# Altium project Mercury_AD_BaseBoard.PrjPcb (part 4 of 4)
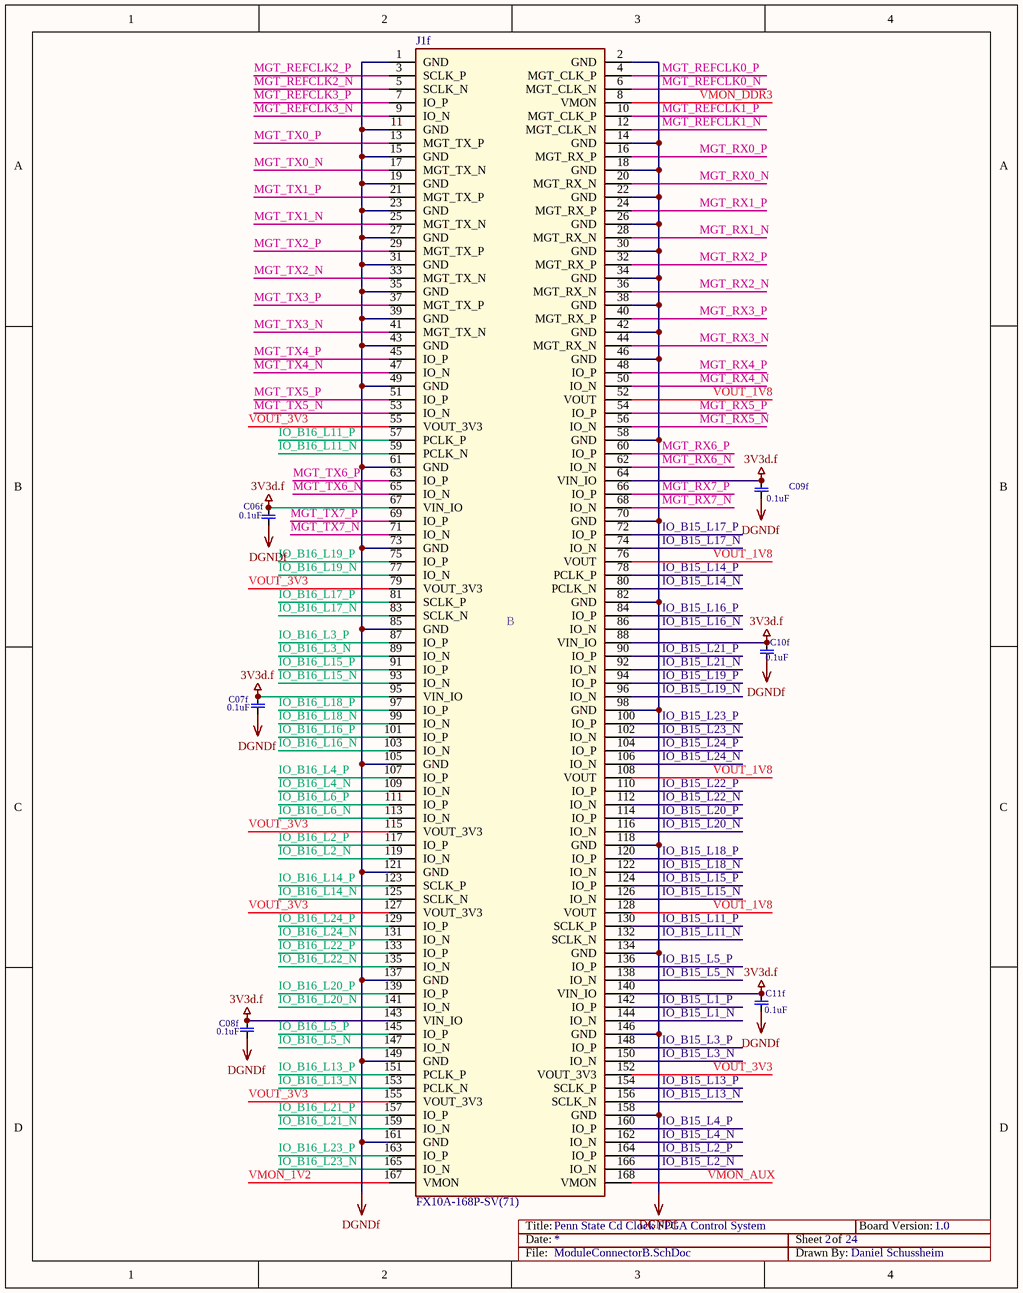
[diagram p24: ModuleConnectorB.SchDoc]

## Nets that join several sheets
1V8a.a: LTC2194_0 (L07a0.1), LTC2194_1 (L07a1.1), LTC2194_2 (L07a2.1), LTC2194_3 (L07a3.1), LTC2194_4 (L07a4.1)
1V8a.b: MAX5875_0 (L09b0.1), MAX5875_1 (L13b1.1), MAX5875_2 (L13b2.1), MAX5875_3 (L13b3.1), MAX5875_4 (L13b4.1), MAX5875_5 (L13b5.1), MAX5875_6 (L13b6.1)
1V8d.a: LTC2194_0 (L06a0.1), LTC2194_1 (L06a1.1), LTC2194_2 (L06a2.1), LTC2194_3 (L06a3.1), LTC2194_4 (L06a4.1)
1V8d.b: MAX5875_0 (L06b0.1), MAX5875_1 (L10b1.1), MAX5875_2 (L10b2.1), MAX5875_3 (L10b3.1), MAX5875_4 (L10b4.1), MAX5875_5 (L10b5.1), MAX5875_6 (L10b6.1)
2V5d.e: Connectors (9 pins), SerialLineShiftRegs (C16e.1 U1e.2 U1e.10)
2V5d.f: ModuleConnectorA (8 pins), fastADCs (Ra1.1)
3V3a.a: LTC2194_0 (L08a0.1 L11a0.1), LTC2194_1 (L08a1.1 L11a1.1), LTC2194_2 (L08a2.1 L11a2.1), LTC2194_3 (L08a3.1 L11a3.1), LTC2194_4 (L08a4.1 L11a4.1)
3V3a.b: MAX5875_0 (L10b0.1), MAX5875_1 (L14b1.1), MAX5875_2 (L14b2.1), MAX5875_3 (L14b3.1), MAX5875_4 (L14b4.1), MAX5875_5 (L14b5.1), MAX5875_6 (L14b6.1)
3V3d.b: MAX5875_0 (L07b0.1 R02b0.2 R05b0.2), MAX5875_1 (L11b1.1 R02b1.2 R05b1.2), MAX5875_2 (L11b2.1 R02b2.2 R05b2.2), MAX5875_3 (L11b3.1 R02b3.2 R05b3.2), MAX5875_4 (L11b4.1 R02b4.2 R05b4.2), MAX5875_5 (L11b5.1 R02b5.2 R05b5.2), MAX5875_6 (L11b6.1 R02b6.2 R05b6.2)
3V3d.c: LTC2335-16_0 (L05c0.1), LTC2335-16_1 (L5c1.1)
3V3d.f: ModuleConnectorC (6 pins), ModuleConnectorB (12 pins)
5.c: LTC2335-16_0 (L04c0.1), LTC2335-16_1 (L4c1.1)
+15.a: LTC2194_0 (L09a0.1), LTC2194_1 (L09a1.1), LTC2194_2 (L09a2.1), LTC2194_3 (L09a3.1), LTC2194_4 (L09a4.1)
+15.c: LTC2335-16_0 (L02c0.1), LTC2335-16_1 (L2c1.1)
+18.b: MAX5875_0 (L11b0.1), MAX5875_1 (L15b1.1), MAX5875_2 (L15b2.1), MAX5875_3 (L15b3.1), MAX5875_4 (L15b4.1), MAX5875_5 (L15b5.1), MAX5875_6 (L15b6.1)
+18.c: LTC2335-16_0 (L00c0.1), LTC2335-16_1 (L0c1.1)
+18.d0: LTC2666-16 (C62d0.1 C63d0.1 L21d0.2), sDAC_filters_0 (16 pins)
+18.d1: LTC2666-16 (C62d1.1 C63d1.1 L21d1.2), sDAC_filters_1 (16 pins)
-15.a: LTC2194_0 (L10a0.1), LTC2194_1 (L10a1.1), LTC2194_2 (L10a2.1), LTC2194_3 (L10a3.1), LTC2194_4 (L10a4.1)
-15.c: LTC2335-16_0 (L03c0.1), LTC2335-16_1 (L3c1.1)
-18.b: MAX5875_0 (L12b0.1), MAX5875_1 (L16b1.1), MAX5875_2 (L16b2.1), MAX5875_3 (L16b3.1), MAX5875_4 (L16b4.1), MAX5875_5 (L16b5.1), MAX5875_6 (L16b6.1)
-18.c: LTC2335-16_0 (L01c0.1), LTC2335-16_1 (L1c1.1)
-18.d0: LTC2666-16 (C64c0.1 C65c0.1 L22d0.2), sDAC_filters_0 (16 pins)
-18.d1: LTC2666-16 (C64c1.1 C65c1.1 L22d1.2), sDAC_filters_1 (16 pins)
AGNDa: ModuleConnectorA (34 pins), fastDACs (20 pins), MAX5875_0 (81 pins), MAX5875_1 (81 pins), MAX5875_2 (81 pins), MAX5875_3 (81 pins), MAX5875_4 (81 pins), MAX5875_5 (81 pins), MAX5875_6 (81 pins), LTC2666-16 (64 pins), sDAC_filters_0 (48 pins), sDAC_filters_1 (48 pins), LTC2335-16_0 (85 pins), LTC2335-16_1 (85 pins), Connectors (20 pins), SerialLineShiftRegs (40 pins), ModuleConnectorC (57 pins), fastADCs (16 pins), LTC2194_0 (66 pins), LTC2194_1 (66 pins), LTC2194_2 (66 pins), LTC2194_3 (66 pins), LTC2194_4 (66 pins), ModuleConnectorB (43 pins)
BOOT_MODE: ModuleConnectorA (J0f.126), Connectors (R04e.2)
ETH0_A_N: ModuleConnectorA (J0f.163), Connectors (J2e.10)
ETH0_A_P: ModuleConnectorA (J0f.165), Connectors (J2e.11)
ETH0_B_N: ModuleConnectorA (J0f.157), Connectors (J2e.5)
ETH0_B_P: ModuleConnectorA (J0f.159), Connectors (J2e.4)
ETH0_C_N: ModuleConnectorA (J0f.151), Connectors (J2e.2)
ETH0_C_P: ModuleConnectorA (J0f.153), Connectors (J2e.3)
ETH0_CTREF: ModuleConnectorA (J0f.155), Connectors (J2e.1 J2e.6 J2e.7 J2e.12)
ETH0_D_N: ModuleConnectorA (J0f.145), Connectors (J2e.9)
ETH0_D_P: ModuleConnectorA (J0f.147), Connectors (J2e.8)
ETH0_LED1#: ModuleConnectorA (J0f.149), Connectors (J2e.14)
ETH0_LED2#: ModuleConnectorA (J0f.161), Connectors (J2e.16)
fDAC0_PD: MAX5875_0 (R04b0.2), ModuleConnectorC (U0f.15)
fDAC1_PD: MAX5875_1 (R04b1.2), ModuleConnectorC (U0f.1)
fDAC2_PD: MAX5875_2 (R04b2.2), ModuleConnectorC (U0f.2)
fDAC3_PD: MAX5875_3 (R04b3.2), ModuleConnectorC (U0f.3)
fDAC4_PD: MAX5875_4 (R04b4.2), ModuleConnectorC (U0f.4)
fDAC5_PD: MAX5875_5 (R04b5.2), ModuleConnectorC (U0f.5)
fDAC6_PD: MAX5875_6 (R04b6.2), ModuleConnectorC (U0f.6)
IO_B12_L1_N: ModuleConnectorA (J0f.66), LTC2194_4 (U5a4.29)
IO_B12_L1_P: ModuleConnectorA (J0f.64), LTC2194_4 (U5a4.30)
IO_B12_L2_N: ModuleConnectorA (J0f.45), LTC2194_1 (U5a1.43)
IO_B12_L2_P: ModuleConnectorA (J0f.43), LTC2194_1 (U5a1.44)
IO_B12_L3_N: ModuleConnectorA (J0f.39), LTC2194_0 (U5a0.27)
IO_B12_L3_P: ModuleConnectorA (J0f.37), LTC2194_0 (U5a0.28)
IO_B12_L4_N: ModuleConnectorA (J0f.63), LTC2194_1 (U5a1.29)
IO_B12_L4_P: ModuleConnectorA (J0f.61), LTC2194_1 (U5a1.30)
IO_B12_L5_N: ModuleConnectorA (J0f.57), LTC2194_1 (U5a1.31)
IO_B12_L5_P: ModuleConnectorA (J0f.55), LTC2194_1 (U5a1.32)
IO_B12_L6_N: ModuleConnectorA (J0f.33), LTC2194_0 (U5a0.29)
IO_B12_L6_P: ModuleConnectorA (J0f.31), LTC2194_0 (U5a0.30)
IO_B12_L7_N: ModuleConnectorA (J0f.75), LTC2194_0 (U5a0.21), LTC2194_1 (U5a1.21), LTC2194_2 (U5a2.21), LTC2194_3 (U5a3.21), LTC2194_4 (U5a4.21)
IO_B12_L7_P: ModuleConnectorA (J0f.73), fastADCs (Ra1.2), LTC2194_0 (U5a0.46), LTC2194_1 (U5a1.46), LTC2194_2 (U5a2.46), LTC2194_3 (U5a3.46), LTC2194_4 (U5a4.46)
IO_B12_L8_N: ModuleConnectorA (J0f.72), LTC2194_4 (U5a4.27)
IO_B12_L8_P: ModuleConnectorA (J0f.70), LTC2194_4 (U5a4.28)
IO_B12_L9_N: ModuleConnectorA (J0f.69), LTC2194_1 (U5a1.27)
IO_B12_L9_P: ModuleConnectorA (J0f.67), LTC2194_1 (U5a1.28)
IO_B12_L10_N: ModuleConnectorA (J0f.84), LTC2194_4 (U5a4.19)
IO_B12_L10_P: ModuleConnectorA (J0f.82), LTC2194_3 (U5a3.19)
IO_B12_L11_N: ModuleConnectorA (J0f.18), LTC2194_3 (U5a3.43)
IO_B12_L11_P: ModuleConnectorA (J0f.16), LTC2194_3 (U5a3.44)
IO_B12_L12_N: ModuleConnectorA (J0f.87), LTC2194_2 (U5a2.43)
IO_B12_L12_P: ModuleConnectorA (J0f.85), LTC2194_2 (U5a2.44)
IO_B12_L13_N: ModuleConnectorA (J0f.48), LTC2194_4 (U5a4.43)
IO_B12_L13_P: ModuleConnectorA (J0f.46), LTC2194_4 (U5a4.44)
IO_B12_L14_N: ModuleConnectorA (J0f.51), LTC2194_1 (U5a1.41)
IO_B12_L14_P: ModuleConnectorA (J0f.49), LTC2194_1 (U5a1.42)
IO_B12_L15_N: ModuleConnectorA (J0f.17), LTC2194_0 (U5a0.43)
IO_B12_L15_P: ModuleConnectorA (J0f.15), LTC2194_0 (U5a0.44)
IO_B12_L16_N: ModuleConnectorA (J0f.60), LTC2194_4 (U5a4.31)
IO_B12_L16_P: ModuleConnectorA (J0f.58), LTC2194_4 (U5a4.32)
IO_B12_L17_N: ModuleConnectorA (J0f.30), LTC2194_3 (U5a3.31)
IO_B12_L17_P: ModuleConnectorA (J0f.28), LTC2194_3 (U5a3.32)
IO_B12_L18_N: ModuleConnectorA (J0f.24), LTC2194_3 (U5a3.41)
IO_B12_L18_P: ModuleConnectorA (J0f.22), LTC2194_3 (U5a3.42)
IO_B12_L19_N: ModuleConnectorA (J0f.21), LTC2194_0 (U5a0.41)
IO_B12_L19_P: ModuleConnectorA (J0f.19), LTC2194_0 (U5a0.42)
IO_B12_L20_N: ModuleConnectorA (J0f.42), LTC2194_3 (U5a3.27)
IO_B12_L20_P: ModuleConnectorA (J0f.40), LTC2194_3 (U5a3.28)
IO_B12_L21_N: ModuleConnectorA (J0f.78), LTC2194_2 (U5a2.19)
IO_B12_L21_P: ModuleConnectorA (J0f.76), LTC2194_1 (U5a1.19)
IO_B12_L22_N: ModuleConnectorA (J0f.36), LTC2194_3 (U5a3.29)
IO_B12_L22_P: ModuleConnectorA (J0f.34), LTC2194_3 (U5a3.30)
IO_B12_L23_N: ModuleConnectorA (J0f.54), LTC2194_4 (U5a4.41)
IO_B12_L23_P: ModuleConnectorA (J0f.52), LTC2194_4 (U5a4.42)
IO_B12_L24_N: ModuleConnectorA (J0f.27), LTC2194_0 (U5a0.31)
IO_B12_L24_P: ModuleConnectorA (J0f.25), LTC2194_0 (U5a0.32)
IO_B12_U21: ModuleConnectorA (J0f.79), LTC2194_0 (U5a0.20), LTC2194_1 (U5a1.20), LTC2194_2 (U5a2.20), LTC2194_3 (U5a3.20), LTC2194_4 (U5a4.20)
IO_B12_Y20: ModuleConnectorA (J0f.81), LTC2194_0 (U5a0.19)
IO_B13_L1_N: MAX5875_6 (U0b6.48), ModuleConnectorC (J2f.144)
IO_B13_L1_P: MAX5875_6 (U0b6.49), ModuleConnectorC (J2f.142)
IO_B13_L4_N: MAX5875_6 (U0b6.54), ModuleConnectorC (J2f.130)
IO_B13_L4_P: MAX5875_6 (U0b6.55), ModuleConnectorC (J2f.128)
IO_B13_L6_N: MAX5875_5 (U0b5.47), ModuleConnectorC (J2f.147)
IO_B13_L6_P: MAX5875_5 (U0b5.48), ModuleConnectorC (J2f.145)
IO_B13_L7_N: MAX5875_5 (U0b5.55), ModuleConnectorC (J2f.127)
IO_B13_L7_P: MAX5875_5 (U0b5.56), ModuleConnectorC (J2f.125)
IO_B13_L8_N: MAX5875_6 (U0b6.44), ModuleConnectorC (J2f.156)
IO_B13_L8_P: MAX5875_6 (U0b6.45), ModuleConnectorC (J2f.154)
IO_B13_L9_N: MAX5875_6 (U0b6.52), ModuleConnectorC (J2f.134)
IO_B13_L9_P: MAX5875_6 (U0b6.53), ModuleConnectorC (J2f.132)
IO_B13_L10_P: MAX5875_5 (U0b5.44), ModuleConnectorC (J2f.157)
IO_B13_L11_N: MAX5875_5 (U0b5.59), ModuleConnectorC (J2f.117)
IO_B13_L11_P: MAX5875_5 (U0b5.60), ModuleConnectorC (J2f.115)
IO_B13_L12_N: MAX5875_6 (U0b6.46), ModuleConnectorC (J2f.150)
IO_B13_L12_P: MAX5875_6 (U0b6.47), ModuleConnectorC (J2f.148)
IO_B13_L13_N: MAX5875_5 (U0b5.45), ModuleConnectorC (J2f.153)
IO_B13_L13_P: MAX5875_5 (U0b5.46), ModuleConnectorC (J2f.151)
IO_B13_L14_N: MAX5875_6 (U0b6.56), ModuleConnectorC (J2f.124)
IO_B13_L14_P: MAX5875_6 (U0b6.57), ModuleConnectorC (J2f.122)
IO_B13_L15_N: MAX5875_5 (U0b5.57), ModuleConnectorC (J2f.121)
IO_B13_L15_P: MAX5875_5 (U0b5.58), ModuleConnectorC (J2f.119)
IO_B13_L16_N: MAX5875_5 (U0b5.49), ModuleConnectorC (J2f.141)
IO_B13_L16_P: MAX5875_5 (U0b5.50), ModuleConnectorC (J2f.139)
IO_B13_L17_N: MAX5875_6 (U0b6.50), ModuleConnectorC (J2f.140)
IO_B13_L17_P: MAX5875_6 (U0b6.51), ModuleConnectorC (J2f.138)
IO_B13_L18_N: MAX5875_5 (U0b5.51), ModuleConnectorC (J2f.137)
IO_B13_L18_P: MAX5875_5 (U0b5.52), ModuleConnectorC (J2f.135)
IO_B13_L19_N: MAX5875_5 (U0b5.53), ModuleConnectorC (J2f.131)
IO_B13_L19_P: MAX5875_5 (U0b5.54), ModuleConnectorC (J2f.129)
IO_B13_L20_N: MAX5875_4 (U0b4.45), ModuleConnectorC (J2f.110)
IO_B13_L20_P: MAX5875_4 (U0b4.46), ModuleConnectorC (J2f.108)
IO_B13_L21_N: MAX5875_3 (R00b3.1), MAX5875_4 (R00b4.1), MAX5875_5 (R00b5.1), MAX5875_6 (R00b6.1), ModuleConnectorC (J2f.111)
IO_B13_L21_P: MAX5875_3 (U0b3.44), ModuleConnectorC (J2f.109)
IO_B13_L22_N: MAX5875_3 (U0b3.45), ModuleConnectorC (J2f.107)
IO_B13_L22_P: MAX5875_3 (U0b3.46), ModuleConnectorC (J2f.105)
IO_B13_L23_N: MAX5875_6 (U0b6.60), ModuleConnectorC (J2f.114)
IO_B13_L23_P: MAX5875_4 (U0b4.44), ModuleConnectorC (J2f.112)
IO_B13_L24_N: MAX5875_6 (U0b6.58), ModuleConnectorC (J2f.120)
IO_B13_L24_P: MAX5875_6 (U0b6.59), ModuleConnectorC (J2f.118)
IO_B14_L4_N: ModuleConnectorA (J0f.103), LTC2194_2 (U5a2.29)
IO_B14_L4_P: ModuleConnectorA (J0f.101), LTC2194_2 (U5a2.30)
IO_B14_L5_N: ModuleConnectorA (J0f.97), LTC2194_2 (U5a2.31)
IO_B14_L5_P: ModuleConnectorA (J0f.95), LTC2194_2 (U5a2.32)
IO_B14_L7_N: ModuleConnectorA (J0f.100), ModuleConnectorC (U2f.3)
IO_B14_L7_P: ModuleConnectorA (J0f.98), ModuleConnectorC (U2f.1)
IO_B14_L8_N: ModuleConnectorA (J0f.107), LTC2194_2 (U5a2.27)
IO_B14_L8_P: ModuleConnectorA (J0f.105), LTC2194_2 (U5a2.28)
IO_B14_L9_N: ModuleConnectorA (J0f.94), SerialLineShiftRegs (U1e.5)
IO_B14_L9_P: ModuleConnectorA (J0f.92), SerialLineShiftRegs (U1e.4)
IO_B14_L10_N: ModuleConnectorA (J0f.93), LTC2194_2 (U5a2.41)
IO_B14_L10_P: ModuleConnectorA (J0f.91), LTC2194_2 (U5a2.42)
IO_B14_L11_N: ModuleConnectorA (J0f.90), SerialLineShiftRegs (U1e.3)
IO_B14_L11_P: ModuleConnectorA (J0f.88), SerialLineShiftRegs (U1e.1)
IO_B14_L12_N: ModuleConnectorA (J0f.106), fastADCs (R0a.2), LTC2194_0 (C35a0.1 R31a0.2), LTC2194_1 (C35a1.1 R31a1.2), LTC2194_2 (C35a2.1 R31a2.2), LTC2194_3 (C35a3.1 R31a3.2), LTC2194_4 (C35a4.1 R31a4.2)
IO_B14_L12_P: ModuleConnectorA (J0f.104), fastADCs (R0a.1), LTC2194_0 (C34a0.1 R31a0.1), LTC2194_1 (C34a1.1 R31a1.1), LTC2194_2 (C34a2.1 R31a2.1), LTC2194_3 (C34a3.1 R31a3.1), LTC2194_4 (C34a4.1 R31a4.1)
IO_B15_K15: MAX5875_4 (U0b4.60), ModuleConnectorC (J2f.72)
IO_B15_L1_N: MAX5875_2 (U0b2.53), ModuleConnectorB (J1f.144)
IO_B15_L1_P: MAX5875_2 (U0b2.52), ModuleConnectorB (J1f.142)
IO_B15_L2_N: SerialLineShiftRegs (U2e.1), ModuleConnectorB (J1f.166)
IO_B15_L2_P: MAX5875_2 (U0b2.60), ModuleConnectorB (J1f.164)
IO_B15_L3_N: MAX5875_2 (U0b2.55), ModuleConnectorB (J1f.150)
IO_B15_L3_P: MAX5875_2 (U0b2.54), ModuleConnectorB (J1f.148)
IO_B15_L4_N: MAX5875_2 (U0b2.59), ModuleConnectorB (J1f.162)
IO_B15_L4_P: MAX5875_2 (U0b2.58), ModuleConnectorB (J1f.160)
IO_B15_L5_N: MAX5875_2 (U0b2.51), ModuleConnectorB (J1f.138)
IO_B15_L5_P: MAX5875_2 (U0b2.50), ModuleConnectorB (J1f.136)
IO_B15_L6_N: MAX5875_4 (U0b4.47), ModuleConnectorC (J2f.104)
IO_B15_L6_P: MAX5875_4 (U0b4.48), ModuleConnectorC (J2f.102)
IO_B15_L7_N: MAX5875_4 (U0b4.49), ModuleConnectorC (J2f.100)
IO_B15_L7_P: MAX5875_4 (U0b4.50), ModuleConnectorC (J2f.98)
IO_B15_L8_N: MAX5875_4 (U0b4.57), ModuleConnectorC (J2f.80)
IO_B15_L8_P: MAX5875_4 (U0b4.58), ModuleConnectorC (J2f.78)
IO_B15_L9_N: MAX5875_4 (U0b4.55), ModuleConnectorC (J2f.84)
IO_B15_L9_P: MAX5875_4 (U0b4.56), ModuleConnectorC (J2f.82)
IO_B15_L10_N: MAX5875_4 (U0b4.51), ModuleConnectorC (J2f.94)
IO_B15_L10_P: MAX5875_4 (U0b4.52), ModuleConnectorC (J2f.92)
IO_B15_L11_N: MAX5875_2 (U0b2.49), ModuleConnectorB (J1f.132)
IO_B15_L11_P: MAX5875_2 (U0b2.48), ModuleConnectorB (J1f.130)
IO_B15_L12_N: MAX5875_4 (U0b4.53), ModuleConnectorC (J2f.90)
IO_B15_L12_P: MAX5875_4 (U0b4.54), ModuleConnectorC (J2f.88)
IO_B15_L13_N: MAX5875_2 (U0b2.57), ModuleConnectorB (J1f.156)
IO_B15_L13_P: MAX5875_2 (U0b2.56), ModuleConnectorB (J1f.154)
IO_B15_L14_N: MAX5875_0 (U0b0.46), ModuleConnectorB (J1f.80)
IO_B15_L14_P: MAX5875_0 (U0b0.45), ModuleConnectorB (J1f.78)
IO_B15_L15_N: MAX5875_2 (U0b2.47), ModuleConnectorB (J1f.126)
IO_B15_L15_P: MAX5875_2 (U0b2.46), ModuleConnectorB (J1f.124)
IO_B15_L16_N: MAX5875_0 (U0b0.48), ModuleConnectorB (J1f.86)
IO_B15_L16_P: MAX5875_0 (U0b0.47), ModuleConnectorB (J1f.84)
IO_B15_L17_N: MAX5875_0 (U0b0.44), ModuleConnectorB (J1f.74)
IO_B15_L17_P: MAX5875_0 (R00b0.2), MAX5875_1 (R00b1.2), MAX5875_2 (R00b2.1), ModuleConnectorB (J1f.72)
IO_B15_L18_N: MAX5875_2 (U0b2.45), ModuleConnectorB (J1f.122)
IO_B15_L18_P: MAX5875_2 (U0b2.44), ModuleConnectorB (J1f.120)
IO_B15_L19_N: MAX5875_0 (U0b0.52), ModuleConnectorB (J1f.96)
IO_B15_L19_P: MAX5875_0 (U0b0.51), ModuleConnectorB (J1f.94)
IO_B15_L20_N: MAX5875_0 (U0b0.60), ModuleConnectorB (J1f.116)
IO_B15_L20_P: MAX5875_0 (U0b0.59), ModuleConnectorB (J1f.114)
IO_B15_L21_N: MAX5875_0 (U0b0.50), ModuleConnectorB (J1f.92)
IO_B15_L21_P: MAX5875_0 (U0b0.49), ModuleConnectorB (J1f.90)
IO_B15_L22_N: MAX5875_0 (U0b0.58), ModuleConnectorB (J1f.112)
IO_B15_L22_P: MAX5875_0 (U0b0.57), ModuleConnectorB (J1f.110)
IO_B15_L23_N: MAX5875_0 (U0b0.54), ModuleConnectorB (J1f.102)
IO_B15_L23_P: MAX5875_0 (U0b0.53), ModuleConnectorB (J1f.100)
IO_B15_L24_N: MAX5875_0 (U0b0.56), ModuleConnectorB (J1f.106)
IO_B15_L24_P: MAX5875_0 (U0b0.55), ModuleConnectorB (J1f.104)
IO_B15_M16: MAX5875_4 (U0b4.59), ModuleConnectorC (J2f.74)
IO_B16_J8: MAX5875_3 (U0b3.60), ModuleConnectorC (J2f.69)
IO_B16_J14: MAX5875_3 (U0b3.59), ModuleConnectorC (J2f.71)
IO_B16_L1_N: MAX5875_3 (U0b3.47), ModuleConnectorC (J2f.101)
IO_B16_L1_P: MAX5875_3 (U0b3.48), ModuleConnectorC (J2f.99)
IO_B16_L2_N: LTC2666-16 (U0d0.15 U0d1.15), ModuleConnectorB (J1f.119)
IO_B16_L2_P: LTC2666-16 (U0d0.16 U0d1.16), ModuleConnectorB (J1f.117)
IO_B16_L3_N: MAX5875_1 (U0b1.51), ModuleConnectorB (J1f.89)
IO_B16_L3_P: MAX5875_1 (U0b1.50), ModuleConnectorB (J1f.87)
IO_B16_L4_N: MAX5875_1 (U0b1.59), ModuleConnectorB (J1f.109)
IO_B16_L4_P: MAX5875_1 (U0b1.58), ModuleConnectorB (J1f.107)
IO_B16_L5_N: LTC2335-16_0 (U0c0.38), ModuleConnectorB (J1f.147)
IO_B16_L5_P: LTC2335-16_0 (U0c0.29), LTC2335-16_1 (U0c1.29), ModuleConnectorB (J1f.145)
IO_B16_L6_N: LTC2666-16 (U0d1.13), ModuleConnectorB (J1f.113)
IO_B16_L6_P: MAX5875_1 (U0b1.60), ModuleConnectorB (J1f.111)
IO_B16_L7_N: MAX5875_3 (U0b3.49), ModuleConnectorC (J2f.97)
IO_B16_L7_P: MAX5875_3 (U0b3.50), ModuleConnectorC (J2f.95)
IO_B16_L8_N: MAX5875_3 (U0b3.53), ModuleConnectorC (J2f.87)
IO_B16_L8_P: MAX5875_3 (U0b3.54), ModuleConnectorC (J2f.85)
IO_B16_L9_N: MAX5875_3 (U0b3.57), ModuleConnectorC (J2f.77)
IO_B16_L9_P: MAX5875_3 (U0b3.58), ModuleConnectorC (J2f.75)
IO_B16_L10_N: MAX5875_3 (U0b3.55), ModuleConnectorC (J2f.81)
IO_B16_L10_P: MAX5875_3 (U0b3.56), ModuleConnectorC (J2f.79)
IO_B16_L11_N: MAX5875_1 (U0b1.45), ModuleConnectorB (J1f.59)
IO_B16_L11_P: MAX5875_1 (U0b1.44), ModuleConnectorB (J1f.57)
IO_B16_L12_N: MAX5875_3 (U0b3.51), ModuleConnectorC (J2f.91)
IO_B16_L12_P: MAX5875_3 (U0b3.52), ModuleConnectorC (J2f.89)
IO_B16_L13_N: LTC2335-16_1 (U0c1.39), ModuleConnectorB (J1f.153)
IO_B16_L13_P: Connectors (U0e.1), SerialLineShiftRegs (U2e.7), ModuleConnectorB (J1f.151)
IO_B16_L14_N: LTC2666-16 (U0d0.13), ModuleConnectorB (J1f.125)
IO_B16_L14_P: LTC2666-16 (U0d0.14 U0d1.14), ModuleConnectorB (J1f.123)
IO_B16_L15_N: MAX5875_1 (U0b1.53), ModuleConnectorB (J1f.93)
IO_B16_L15_P: MAX5875_1 (U0b1.52), ModuleConnectorB (J1f.91)
IO_B16_L16_N: MAX5875_1 (U0b1.57), ModuleConnectorB (J1f.103)
IO_B16_L16_P: MAX5875_1 (U0b1.56), ModuleConnectorB (J1f.101)
IO_B16_L17_N: MAX5875_1 (U0b1.49), ModuleConnectorB (J1f.83)
IO_B16_L17_P: MAX5875_1 (U0b1.48), ModuleConnectorB (J1f.81)
IO_B16_L18_N: MAX5875_1 (U0b1.55), ModuleConnectorB (J1f.99)
IO_B16_L18_P: MAX5875_1 (U0b1.54), ModuleConnectorB (J1f.97)
IO_B16_L19_N: MAX5875_1 (U0b1.47), ModuleConnectorB (J1f.77)
IO_B16_L19_P: MAX5875_1 (U0b1.46), ModuleConnectorB (J1f.75)
IO_B16_L20_N: LTC2335-16_0 (U0c0.33), ModuleConnectorB (J1f.141)
IO_B16_L20_P: LTC2335-16_1 (U0c1.38), ModuleConnectorB (J1f.139)
IO_B16_L21_N: SerialLineShiftRegs (U2e.4), ModuleConnectorB (J1f.159)
IO_B16_L21_P: SerialLineShiftRegs (U2e.3), ModuleConnectorB (J1f.157)
IO_B16_L22_N: LTC2335-16_0 (U0c0.24), LTC2335-16_1 (U0c1.24), ModuleConnectorB (J1f.135)
IO_B16_L22_P: LTC2335-16_0 (U0c0.37), LTC2335-16_1 (U0c1.37), ModuleConnectorB (J1f.133)
IO_B16_L23_N: SerialLineShiftRegs (U2e.6), ModuleConnectorB (J1f.165)
IO_B16_L23_P: SerialLineShiftRegs (U2e.5), ModuleConnectorB (J1f.163)
IO_B16_L24_N: LTC2335-16_0 (U0c0.39), ModuleConnectorB (J1f.131)
IO_B16_L24_P: LTC2335-16_1 (U0c1.33), ModuleConnectorB (J1f.129)
JTAG_TCK: ModuleConnectorA (J0f.123), Connectors (D0e.1 R01e.2)
JTAG_TDI: ModuleConnectorA (J0f.117), Connectors (D0e.4 R03e.2)
JTAG_TDO: ModuleConnectorA (J0f.121), Connectors (D0e.6 R02e.2)
JTAG_TMS: ModuleConnectorA (J0f.119), Connectors (D0e.3 R00e.1)
POR#_LOAD#: ModuleConnectorA (J0f.132), Connectors (C02e.1 C03e.1 D2e.2)
PWR_GOOD: ModuleConnectorA (J0f.12), Connectors (D2e.1 D3e.1)
sADC0_PD: LTC2335-16_0 (R40c0.2 U0c0.22), ModuleConnectorC (U0f.7)
sADC1_PD: LTC2335-16_1 (R40c1.2 U0c1.22), ModuleConnectorC (U1f.15)
SOUT0_INT: LTC2666-16 (R03d0.2), sDAC_filters_0 (R12d0.1)
SOUT1_INT: LTC2666-16 (R04d0.2), sDAC_filters_0 (R16d0.1)
SOUT2_INT: LTC2666-16 (R05d0.2), sDAC_filters_0 (R20d0.1)
SOUT3_INT: LTC2666-16 (R06d0.2), sDAC_filters_0 (R24d0.1)
SOUT4_INT: LTC2666-16 (R07d0.2), sDAC_filters_0 (R28d0.1)
SOUT5_INT: LTC2666-16 (R08d0.2), sDAC_filters_0 (R32d0.1)
SOUT6_INT: LTC2666-16 (R09d0.2), sDAC_filters_0 (R36d0.1)
SOUT7_INT: LTC2666-16 (R10d0.2), sDAC_filters_0 (R40d0.1)
SOUT8_INT: LTC2666-16 (R03d1.2), sDAC_filters_1 (R12d1.1)
SOUT9_INT: LTC2666-16 (R04d1.2), sDAC_filters_1 (R16d1.1)
SOUT10_INT: LTC2666-16 (R05d1.2), sDAC_filters_1 (R20d1.1)
SOUT11_INT: LTC2666-16 (R06d1.2), sDAC_filters_1 (R24d1.1)
SOUT12_INT: LTC2666-16 (R07d1.2), sDAC_filters_1 (R28d1.1)
SOUT13_INT: LTC2666-16 (R08d1.2), sDAC_filters_1 (R32d1.1)
SOUT14_INT: LTC2666-16 (R09d1.2), sDAC_filters_1 (R36d1.1)
SOUT15_INT: LTC2666-16 (R10d1.2), sDAC_filters_1 (R40d1.1)
SRST#_RDY#: ModuleConnectorA (J0f.124), Connectors (C04e.1 C05e.1 D3e.2)
USB_D_N: ModuleConnectorA (J0f.129), Connectors (D1e.1 J1e.D-)
USB_D_P: ModuleConnectorA (J0f.127), Connectors (D1e.3 J1e.D+)
USB_VBUS: ModuleConnectorA (J0f.131), Connectors (R05e.1)
VOUT_3V3: ModuleConnectorA (J0f.26 J0f.29 J0f.50 J0f.86), ModuleConnectorB (6 pins)